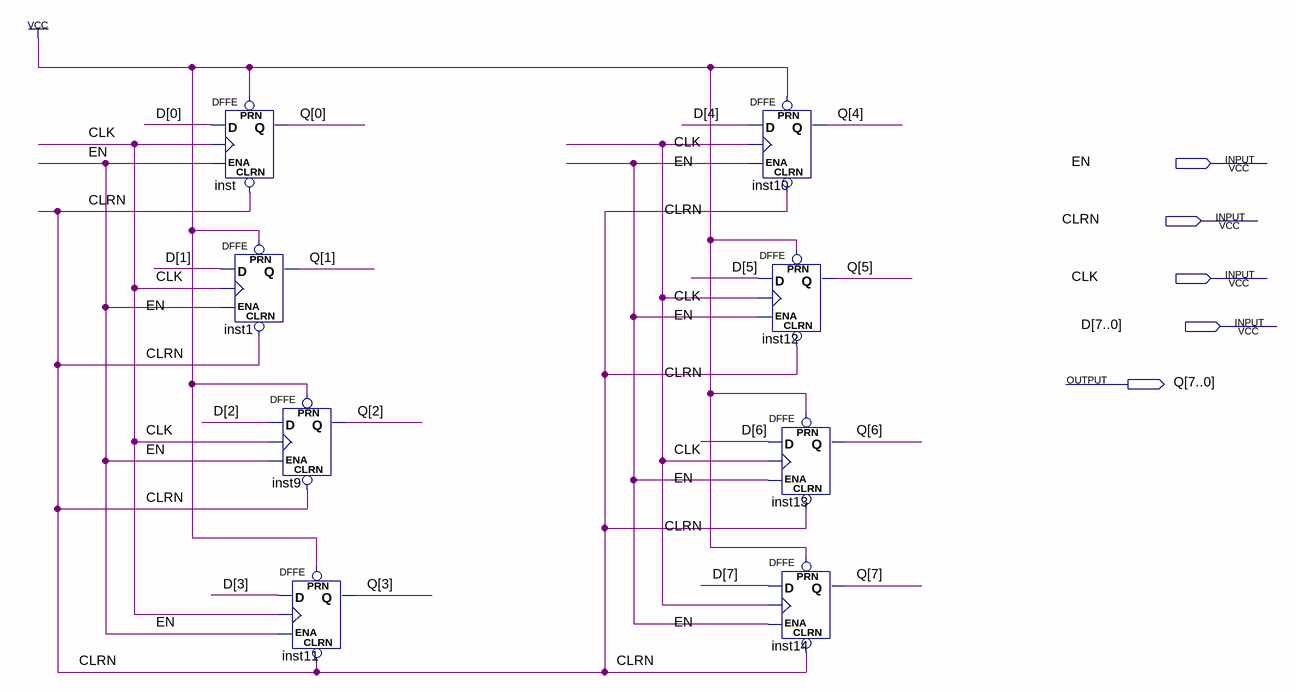
[diagram p0: schematic sheet]
// Quartus schematic dffe8.bdf as structural Verilog: 8 symbols, 5 pins
module dffe8 (
  input  EN,
  input  CLRN,
  input  CLK,
  input  [7:0] D,
  output [7:0] Q
);

  DFFE inst (.PRN(1'b1), .CLRN(CLRN), .D(D[0]), .CLK(CLK), .ENA(EN), .Q(Q[0]));
  DFFE inst1 (.PRN(1'b1), .CLRN(CLRN), .D(D[1]), .CLK(CLK), .ENA(EN), .Q(Q[1]));
  DFFE inst9 (.PRN(1'b1), .CLRN(CLRN), .D(D[2]), .CLK(CLK), .ENA(EN), .Q(Q[2]));
  DFFE inst11 (.PRN(1'b1), .CLRN(CLRN), .D(D[3]), .CLK(CLK), .ENA(EN), .Q(Q[3]));
  DFFE inst10 (.PRN(1'b1), .CLRN(CLRN), .D(D[4]), .CLK(CLK), .ENA(EN), .Q(Q[4]));
  DFFE inst12 (.PRN(1'b1), .CLRN(CLRN), .D(D[5]), .CLK(CLK), .ENA(EN), .Q(Q[5]));
  DFFE inst13 (.PRN(1'b1), .CLRN(CLRN), .D(D[6]), .CLK(CLK), .ENA(EN), .Q(Q[6]));
  DFFE inst14 (.PRN(1'b1), .CLRN(CLRN), .D(D[7]), .CLK(CLK), .ENA(EN), .Q(Q[7]));
endmodule
